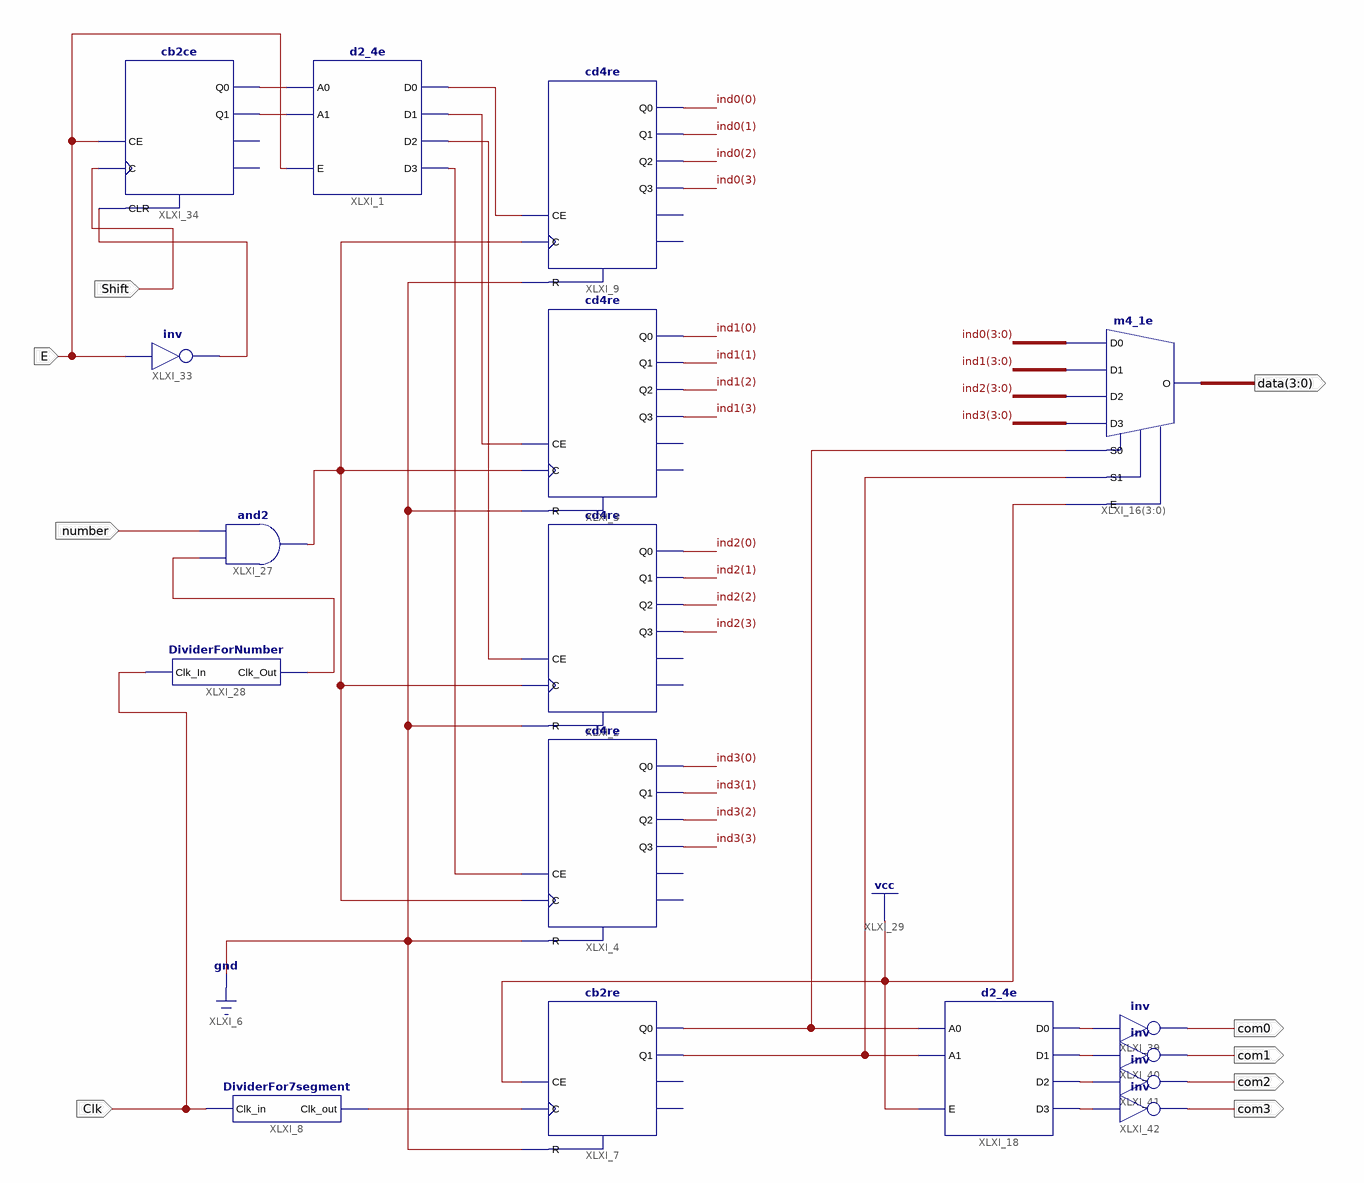
[diagram p0: schematic sheet 1]
// Xilinx ISE schematic Increase2.sch (spartan6) as structural Verilog: 17 symbols, 9 ports
module Increase2 (
  input  Shift,
  input  number,
  input  E,
  input  Clk,
  output [3:0] data,
  output com0,
  output com1,
  output com2,
  output com3
);

  wire Add, XLXN_1, XLXN_27, XLXN_36, XLXN_42, XLXN_110, XLXN_111, XLXN_123, XLXN_124, XLXN_125, XLXN_126,
       XLXN_169, XLXN_181, XLXN_224, XLXN_230, XLXN_236;
  wire [3:0] ind0, ind1, ind2, ind3;

  d2_4e XLXI_1 (.A0(XLXN_1), .A1(XLXN_27), .E(E), .D0(XLXN_36), .D1(XLXN_236), .D2(XLXN_42), .D3(XLXN_224));
  cd4re XLXI_2 (
    .C(Add), .CE(XLXN_42), .R(1'b0), .Q0(ind2[0]), .Q1(ind2[1]), .Q2(ind2[2]), .Q3(ind2[3]));  // open: CEO, TC
  cd4re XLXI_3 (
    .C(Add), .CE(XLXN_236), .R(1'b0), .Q0(ind1[0]), .Q1(ind1[1]), .Q2(ind1[2]), .Q3(ind1[3]));  // open: CEO, TC
  m4_1e XLXI_16[3:0] (.D0(ind0), .D1(ind1), .D2(ind2), .D3(ind3), .E(1'b1), .S0(XLXN_110), .S1(XLXN_111), .O(data));
  cd4re XLXI_4 (
    .C(Add), .CE(XLXN_224), .R(1'b0), .Q0(ind3[0]), .Q1(ind3[1]), .Q2(ind3[2]), .Q3(ind3[3]));  // open: CEO, TC
  cb2re XLXI_7 (.C(XLXN_230), .CE(1'b1), .R(1'b0), .Q0(XLXN_110), .Q1(XLXN_111));  // open: CEO, TC
  DividerFor7segment XLXI_8 (.Clk_in(Clk), .Clk_out(XLXN_230));
  and XLXI_27 (Add, XLXN_169, number);
  DividerForNumber XLXI_28 (.Clk_In(Clk), .Clk_Out(XLXN_169));
  not XLXI_33 (XLXN_181, E);
  cb2ce XLXI_34 (.C(Shift), .CE(E), .CLR(XLXN_181), .Q0(XLXN_1), .Q1(XLXN_27));  // open: CEO, TC
  d2_4e XLXI_18 (.A0(XLXN_110), .A1(XLXN_111), .E(1'b1), .D0(XLXN_123), .D1(XLXN_124), .D2(XLXN_125), .D3(XLXN_126));
  not XLXI_39 (com0, XLXN_123);
  not XLXI_40 (com1, XLXN_124);
  not XLXI_41 (com2, XLXN_125);
  not XLXI_42 (com3, XLXN_126);
  cd4re XLXI_9 (
    .C(Add), .CE(XLXN_36), .R(1'b0), .Q0(ind0[0]), .Q1(ind0[1]), .Q2(ind0[2]), .Q3(ind0[3]));  // open: CEO, TC
endmodule
